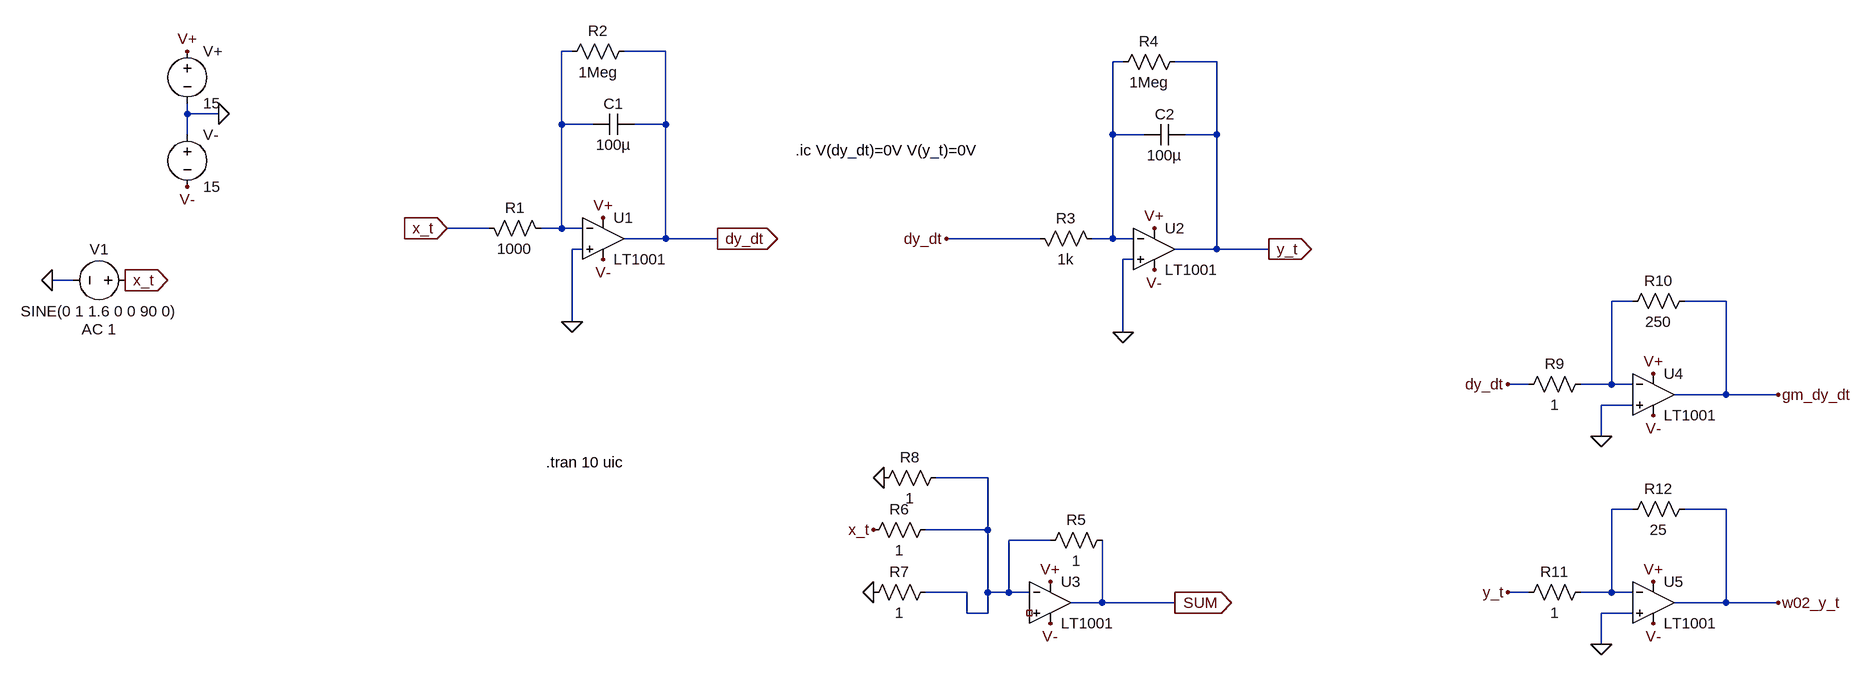
[diagram p0: schematic Analogue_Computer_1.asc]
Analogue_Computer_1.asc, the LTspice schematic file:
Version 4
SHEET 1 1864 680
WIRE -128 -304 -144 -304
WIRE 16 -304 -48 -304
WIRE 720 -288 704 -288
WIRE 864 -288 800 -288
WIRE -720 -208 -720 -224
WIRE -672 -208 -720 -208
WIRE -144 -192 -144 -304
WIRE -96 -192 -144 -192
WIRE 16 -192 16 -304
WIRE 16 -192 -32 -192
WIRE -720 -176 -720 -208
WIRE 704 -176 704 -288
WIRE 752 -176 704 -176
WIRE 864 -176 864 -288
WIRE 864 -176 816 -176
WIRE -256 -32 -320 -32
WIRE -144 -32 -144 -192
WIRE -144 -32 -176 -32
WIRE -112 -32 -144 -32
WIRE 16 -16 16 -192
WIRE 16 -16 -48 -16
WIRE 96 -16 16 -16
WIRE 592 -16 448 -16
WIRE 704 -16 704 -176
WIRE 704 -16 672 -16
WIRE 736 -16 704 -16
WIRE -112 0 -128 0
WIRE 864 0 864 -176
WIRE 864 0 800 0
WIRE 944 0 864 0
WIRE 736 16 720 16
WIRE -896 48 -928 48
WIRE 1504 80 1472 80
WIRE 1648 80 1584 80
WIRE -128 112 -128 0
WIRE 720 128 720 16
WIRE 1344 208 1312 208
WIRE 1472 208 1472 80
WIRE 1472 208 1424 208
WIRE 1504 208 1472 208
WIRE 1648 224 1648 80
WIRE 1648 224 1568 224
WIRE 1728 224 1648 224
WIRE 1504 240 1456 240
WIRE 1456 288 1456 240
WIRE 512 352 432 352
WIRE 1504 400 1472 400
WIRE 1648 400 1584 400
WIRE 512 432 512 352
WIRE 512 432 416 432
WIRE 608 448 544 448
WIRE 480 528 416 528
WIRE 512 528 512 432
WIRE 544 528 544 448
WIRE 544 528 512 528
WIRE 576 528 544 528
WIRE 1344 528 1312 528
WIRE 1472 528 1472 400
WIRE 1472 528 1424 528
WIRE 1504 528 1472 528
WIRE 688 544 688 448
WIRE 688 544 640 544
WIRE 800 544 688 544
WIRE 1648 544 1648 400
WIRE 1648 544 1568 544
WIRE 1728 544 1648 544
WIRE 480 560 480 528
WIRE 512 560 512 528
WIRE 512 560 480 560
WIRE 1504 560 1456 560
WIRE 1456 608 1456 560
FLAG -928 48 0
FLAG -672 -208 0
FLAG -720 -304 V+
FLAG -720 -96 V-
FLAG -80 -48 V+
FLAG -80 16 V-
FLAG 96 -16 dy_dt
IOPIN 96 -16 Out
FLAG -128 112 0
FLAG 768 -32 V+
FLAG 768 32 V-
FLAG 944 0 y_t
IOPIN 944 0 Out
FLAG 720 128 0
FLAG 448 -16 dy_dt
FLAG -816 48 x_t
IOPIN -816 48 Out
FLAG -320 -32 x_t
IOPIN -320 -32 In
FLAG 608 512 V+
FLAG 608 576 V-
FLAG 800 544 SUM
IOPIN 800 544 Out
FLAG 336 432 x_t
FLAG 1536 192 V+
FLAG 1536 256 V-
FLAG 1456 288 0
FLAG 1312 208 dy_dt
FLAG 1728 224 gm_dy_dt
FLAG 1536 512 V+
FLAG 1536 576 V-
FLAG 1456 608 0
FLAG 1312 528 y_t
FLAG 1728 544 w02_y_t
FLAG 336 528 0
FLAG 352 352 0
SYMBOL OpAmps\\LT1001 -80 -80 R0
SYMATTR InstName U1
SYMBOL res -272 -48 M90
WINDOW 0 0 56 VBottom 2
WINDOW 3 32 56 VTop 2
SYMATTR InstName R1
SYMATTR Value 1000
SYMBOL voltage -800 48 R90
WINDOW 0 -32 56 VBottom 2
WINDOW 3 32 56 VTop 2
WINDOW 123 60 56 VTop 2
WINDOW 39 0 0 Left 0
SYMATTR InstName V1
SYMATTR Value SINE(0 1 1.6 0 0 90 0)
SYMATTR Value2 AC 1
SYMBOL voltage -720 -320 R0
WINDOW 123 0 0 Left 0
WINDOW 39 0 0 Left 0
SYMATTR InstName V+
SYMATTR Value 15
SYMBOL voltage -720 -192 R0
WINDOW 123 0 0 Left 0
WINDOW 39 0 0 Left 0
SYMATTR InstName V-
SYMATTR Value 15
SYMBOL cap -32 -208 R90
WINDOW 0 0 32 VBottom 2
WINDOW 3 32 32 VTop 2
SYMATTR InstName C1
SYMATTR Value 100µ
SYMBOL res -32 -320 R90
WINDOW 0 0 56 VBottom 2
WINDOW 3 32 56 VTop 2
SYMATTR InstName R2
SYMATTR Value 1Meg
SYMBOL OpAmps\\LT1001 768 -64 R0
SYMATTR InstName U2
SYMBOL res 576 -32 M90
WINDOW 0 0 56 VBottom 2
WINDOW 3 32 56 VTop 2
SYMATTR InstName R3
SYMATTR Value 1k
SYMBOL cap 816 -192 R90
WINDOW 0 0 32 VBottom 2
WINDOW 3 32 32 VTop 2
SYMATTR InstName C2
SYMATTR Value 100µ
SYMBOL res 816 -304 R90
WINDOW 0 0 56 VBottom 2
WINDOW 3 32 56 VTop 2
SYMATTR InstName R4
SYMATTR Value 1Meg
SYMBOL OpAmps\\LT1001 608 480 R0
SYMATTR InstName U3
SYMBOL res 704 432 R90
WINDOW 0 0 56 VBottom 2
WINDOW 3 32 56 VTop 2
SYMATTR InstName R5
SYMATTR Value 1
SYMBOL res 432 416 R90
WINDOW 0 0 56 VBottom 2
WINDOW 3 32 56 VTop 2
SYMATTR InstName R6
SYMATTR Value 1
SYMBOL res 432 512 R90
WINDOW 0 0 56 VBottom 2
WINDOW 3 32 56 VTop 2
SYMATTR InstName R7
SYMATTR Value 1
SYMBOL OpAmps\\LT1001 1536 160 R0
SYMATTR InstName U4
SYMBOL res 1440 192 R90
WINDOW 0 0 56 VBottom 2
WINDOW 3 32 56 VTop 2
SYMATTR InstName R9
SYMATTR Value 1
SYMBOL res 1600 64 R90
WINDOW 0 0 56 VBottom 2
WINDOW 3 32 56 VTop 2
SYMATTR InstName R10
SYMATTR Value 250
SYMBOL OpAmps\\LT1001 1536 480 R0
SYMATTR InstName U5
SYMBOL res 1440 512 R90
WINDOW 0 0 56 VBottom 2
WINDOW 3 32 56 VTop 2
SYMATTR InstName R11
SYMATTR Value 1
SYMBOL res 1600 384 R90
WINDOW 0 0 56 VBottom 2
WINDOW 3 32 56 VTop 2
SYMATTR InstName R12
SYMATTR Value 25
SYMBOL res 448 336 R90
WINDOW 0 0 56 VBottom 2
WINDOW 3 32 56 VTop 2
SYMATTR InstName R8
SYMATTR Value 1
TEXT -168 328 Left 2 !.tran 10 uic
TEXT 216 -152 Left 2 !.ic V(dy_dt)=0V V(y_t)=0V

The netlist it stands for:
* Analogue_Computer_1.asc
XU1 0 N001 V+ V- dy_dt LT1001  ; pins In+ In- V+ V- OUT
R1 x_t N001 1000
V1 x_t 0 SINE(0 1 1.6 0 0 90 0) AC 1
V+ V+ 0 15
V- 0 V- 15
C1 dy_dt N001 100µ
R2 dy_dt N001 1Meg
XU2 0 N002 V+ V- y_t LT1001  ; pins In+ In- V+ V- OUT
R3 dy_dt N002 1k
C2 y_t N002 100µ
R4 y_t N002 1Meg
XU3 NC_01 N004 V+ V- SUM LT1001  ; pins In+ In- V+ V- OUT
R5 SUM N004 1
R6 N004 x_t 1
R7 N004 0 1
XU4 0 N003 V+ V- gm_dy_dt LT1001  ; pins In+ In- V+ V- OUT
R9 N003 dy_dt 1
R10 gm_dy_dt N003 250
XU5 0 N005 V+ V- w02_y_t LT1001  ; pins In+ In- V+ V- OUT
R11 N005 y_t 1
R12 w02_y_t N005 25
R8 N004 0 1
.tran 10 uic
.ic V(dy_dt)=0V V(y_t)=0V
.lib LTC.lib
.backanno
.end

* Results of the author's LTspice run, read from the files saved beside the schematic
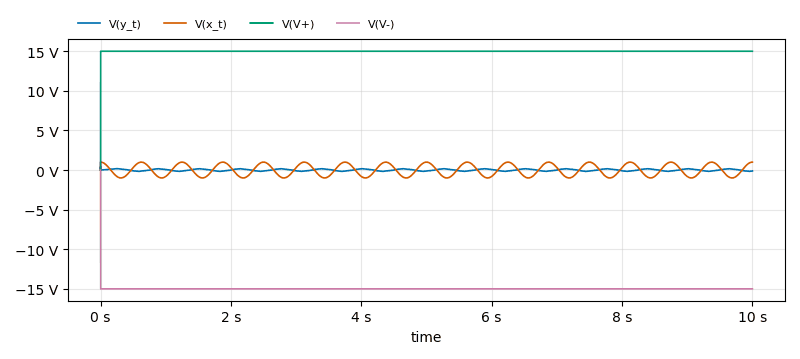
[diagram p1: Transient Analysis of Analogue_Computer_1.asc, plotted from the saved traces]
* Transient Analysis, 1 run:
*   V(y_t): min -183.3 mV, max 442.8 mV, average 1.383 mV, rms 104 mV, last -118.4 mV
*   V(x_t): min -1 V, max 1 V, average 1.485 µV, rms 707.2 mV, last 1 V
*   V(V+): min 0 V, max 15 V, average 15 V, rms 15 V, last 15 V
*   V(V-): min -15 V, max 0 V, average -15 V, rms 15 V, last -15 V